# EAGLE design SparkFun RTK Facet - Display SD SIM (EAGLE 9.6.2)
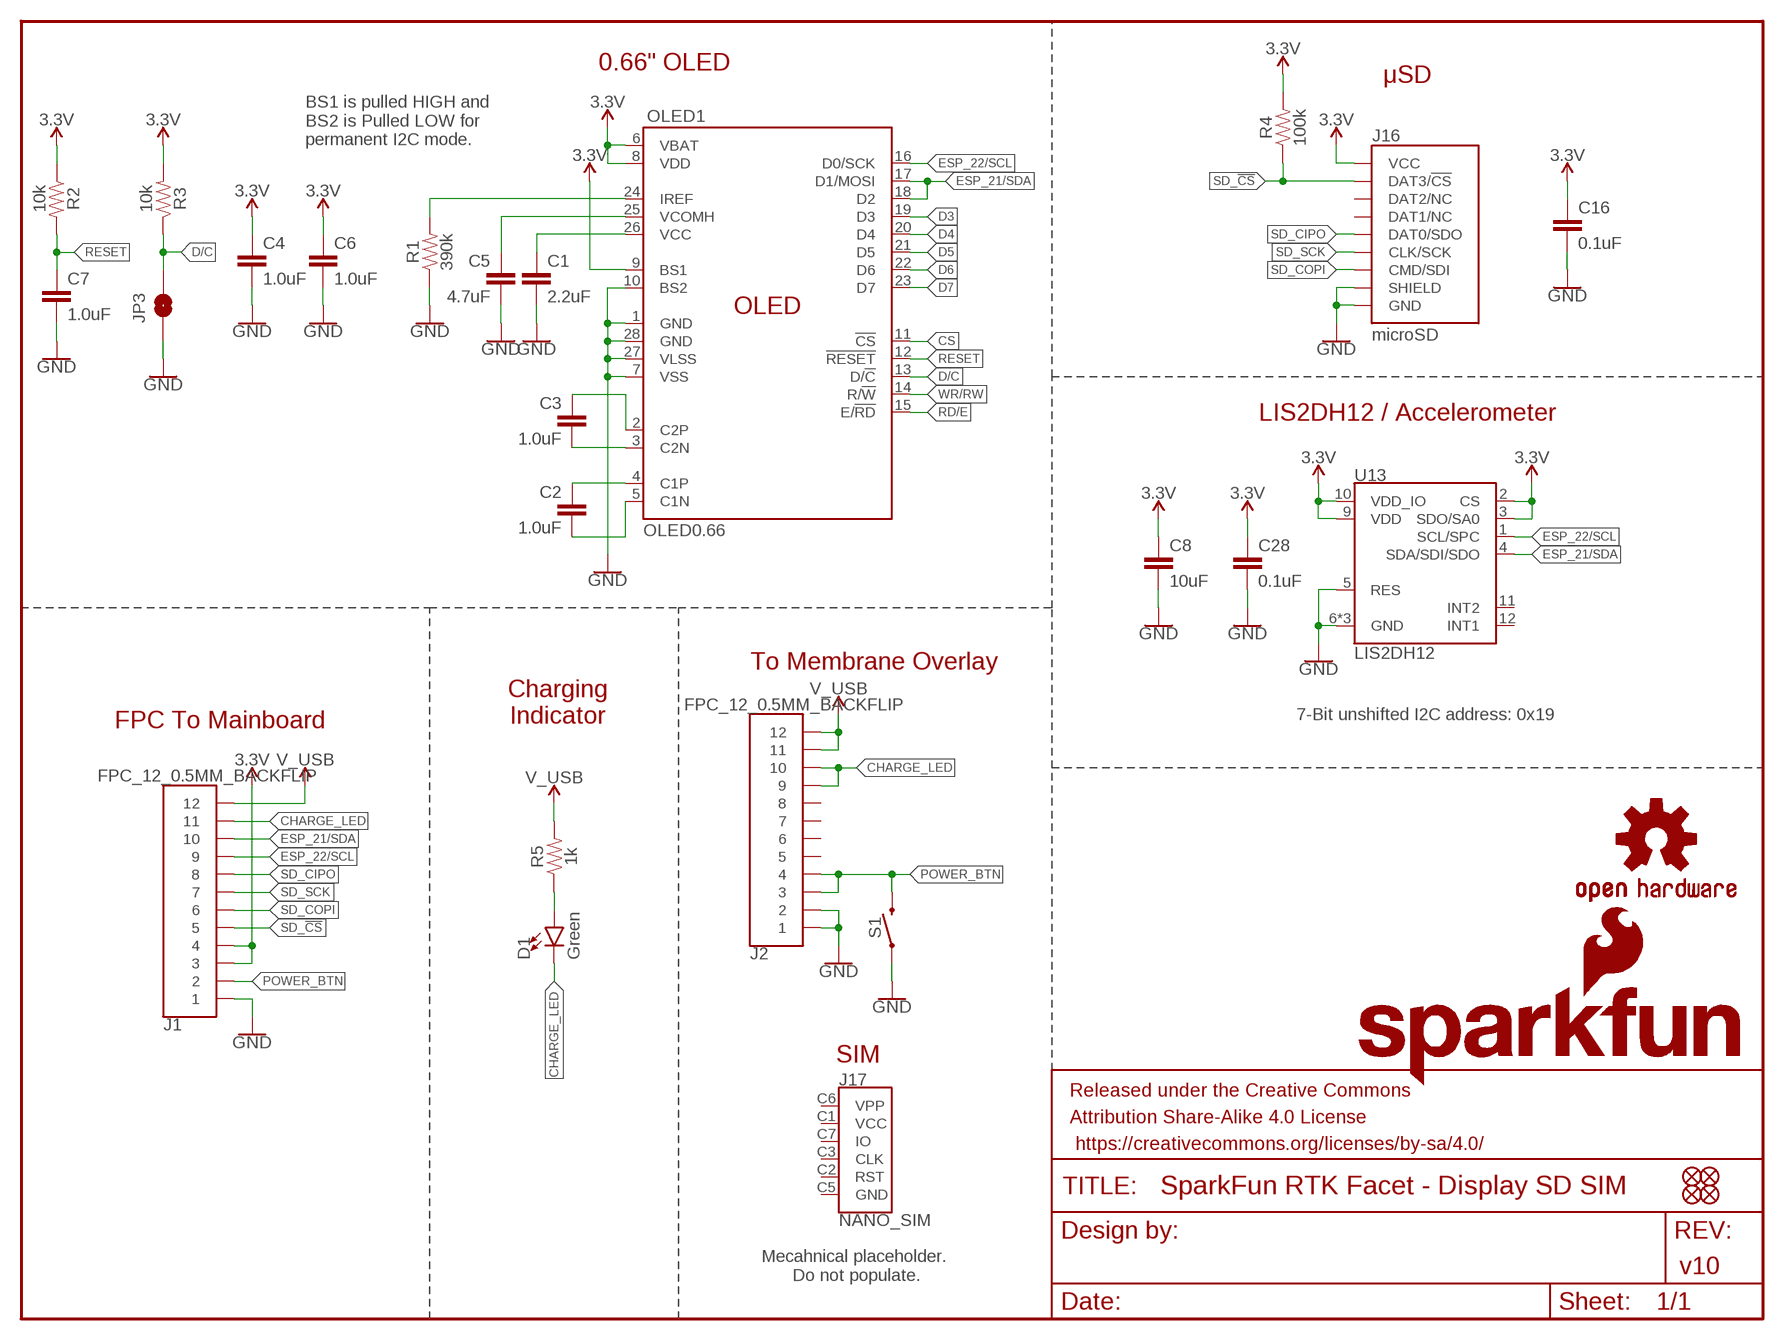
[diagram p0: schematic, sheet 1]

## Parts
C1  2.2uF  2.2UF-0805-25V-(+80/-20%)  [0805]
C2  1.0uF  1.0UF-0805-25V-10%  [0805]
C3  1.0uF  1.0UF-0805-25V-10%  [0805]
C4  1.0uF  1.0UF-0603-16V-10%  [0603]
C5  4.7uF  4.7UF-1206-16V-(+80/-20%)  [1206]
C6  1.0uF  1.0UF-0603-16V-10%  [0603]
C7  1.0uF  1.0UF-0603-16V-10%  [0603]
C8  10uF  10UF-0603-6.3V-20%  [0603]
C16  0.1uF  0.1UF-0603-25V-(+80/-20%)  [0603]
C28  0.1uF  0.1UF-0603-25V-(+80/-20%)  [0603]
D1  Green  LED-GREEN1206-BOTTOM  [LED-1206-BOTTOM]
FID1  FIDUCIAL1X2  [FIDUCIAL-1X2]
FID2  FIDUCIAL1X2  [FIDUCIAL-1X2]
FID3  FIDUCIAL1X2  [FIDUCIAL-1X2]
FID4  FIDUCIAL1X2  [FIDUCIAL-1X2]
FRAME1  FRAME-LETTER  [CREATIVE_COMMONS]
J1  FPC_12_0.5MM_BACKFLIP  [FPC_12_DOUBLESIDED_BACKFLIP]
J2  FPC_12_0.5MM_BACKFLIP  [FPC_12_DOUBLESIDED_BACKFLIP]
J16  microSD  MICRO-SD-SDIOPUSH-PUSH  [MICRO-SD-SOCKET]
J17  NANO_SIM  NANO_SIMWURTH  [NANO_SIM_WURTH_693043020611]
JP3  JUMPER-SMT_2_NO_SILK  [SMT-JUMPER_2_NO_SILK]
LOGO3  OSHW-LOGOMINI  [OSHW-LOGO-MINI]
LOGO5  SFE_LOGO_NAME_FLAME.1_INCH  [SFE_LOGO_NAME_FLAME_.1]
OLED1  OLED0.66  [OLED-0.66-64X48]
R1  390k  390KOHM-0603-1/10W-1%  [0603]
R2  10k  10KOHM-0603-1/10W-1%  [0603]
R3  10k  10KOHM-0603-1/10W-1%  [0603]
R4  100k  100KOHM-0603-1/10W-1%  [0603]
R5  1k  1KOHM-0603-1/10W-1%  [0603]
S1  MOMENTARY-SWITCH-SPST-SMD-5.2MM-TALL  [TACTILE_SWITCH_SMD_5.2MM]
U13  LIS2DH12  [LGA-12-LISDH12]

## Nets
3.3V [power]: C4.1 C6.1 C8.1 C16.1 C28.1 J1.3 J1.4 J16.VCC OLED1.6(VBAT) OLED1.8(VDD) OLED1.9(BS1) R2.1 R3.2 R4.2 U13.2(CS) U13.3(SDO/SA0) U13.9(VDD) U13.10(VDD_IO)
C1P: C2.1 OLED1.4(C1P)
C2N: C3.2 OLED1.3(C2N)
CHARGE_LED: D1.C J1.11 J2.9 J2.10
CS: OLED1.11(!CS!)
D3: OLED1.19(D3)
D4: OLED1.20(D4)
D5: OLED1.21(D5)
D6: OLED1.22(D6)
D7: OLED1.23(D7)
D/C: JP3.2 OLED1.13(D/!C!) R3.1
ESP_21/SDA: J1.10 OLED1.17(D1/MOSI) OLED1.18(D2) U13.4(SDA/SDI/SDO)
ESP_22/SCL: J1.9 OLED1.16(D0/SCK) U13.1(SCL/SPC)
GND: C1.2 C4.2 C5.2 C6.2 C7.2 C8.2 C16.2 C28.2 J1.1 J2.1 J2.2 J16.CD1(SHIELD) J16.GND J16.GND1(GND) J16.GND3(GND) JP3.1 OLED1.1(GND) OLED1.7(VSS) OLED1.10(BS2) OLED1.27(VLSS) OLED1.28(GND) R1.1 S1.1 U13.5(RES) U13.6(GND) U13.7(GND) U13.8(GND)
IREF: OLED1.24(IREF) R1.2
N$1: C3.1 OLED1.2(C2P)
N$2: C2.2 OLED1.5(C1N)
N$3: D1.A R5.1
POWER_BTN: J1.2 J2.3 J2.4 S1.3
RD/E: OLED1.15(E/!RD!)
RESET: C7.1 OLED1.12(!RESET!) R2.2
SD_!CS!: J1.5 J16.CS/DAT3(DAT3/!CS!) R4.1
SD_CIPO: J1.8 J16.DO/DAT0(DAT0/SDO)
SD_COPI: J1.6 J16.DI/CMD(CMD/SDI)
SD_SCK: J1.7 J16.SCLK(CLK/SCK)
V_USB: J1.12 J2.11 J2.12 R5.2
VCC: C1.1 OLED1.26(VCC)
VCOMH: C5.1 OLED1.25(VCOMH)
WR/RW: OLED1.14(R/!W!)
Unconnected: J2.5 J2.6 J2.7 J2.8 J16.DAT1(DAT1/NC) J16.DAT2(DAT2/NC) J17.C1(VCC) J17.C2(RST) J17.C3(CLK) J17.C5(GND) J17.C6(VPP) J17.C7(IO) U13.11(INT2) U13.12(INT1)

## Notes on the sheet
- 0.66" OLED
- μSD
- BS1 is pulled HIGH and 
  BS2 is Pulled LOW for 
  permanent I2C mode.
- LIS2DH12 / Accelerometer
- To Membrane Overlay
- Charging
  Indicator
- 7-Bit unshifted I2C address: 0x19
- FPC To Mainboard
- SIM
- Mecahnical placeholder. 
  Do not populate.
- v10

## Library data of the parts
C1 = SparkFun-Capacitors:2.2UF: 2.2µF ceramic capacitors A capacitor is a passive two-terminal electrical component used to store electrical energy temporarily in an electric field.; PROD_ID: CAP-11624
C2 C3 = SparkFun-Capacitors:1.0UF: 1µF ceramic capacitors A capacitor is a passive two-terminal electrical component used to store electrical energy temporarily in an electric field.; PROD_ID: CAP-08064
C4 C6 C7 = SparkFun-Capacitors:1.0UF: 1µF ceramic capacitors A capacitor is a passive two-terminal electrical component used to store electrical energy temporarily in an electric field.; PROD_ID: CAP-00868
C5 = SparkFun-Capacitors:4.7UF: 4.7µF ceramic capacitors A capacitor is a passive two-terminal electrical component used to store electrical energy temporarily in an electric field.; PROD_ID: CAP-10300
C8 = SparkFun-Capacitors:10UF: 10.0µF ceramic capacitors A capacitor is a passive two-terminal electrical component used to store electrical energy temporarily in an electric field.; PROD_ID: CAP-11015
C16 C28 = SparkFun-Capacitors:0.1UF: 0.1µF ceramic capacitors A capacitor is a passive two-terminal electrical component used to store electrical energy temporarily in an electric field.; PROD_ID: CAP-00810
D1 = SparkFun-LED:LED-GREEN: Green SMD LED Used in manufacturing of various products at SparkFun Packages: 0603 - SMD 0603 package [Product Link] <http://www.futureelectronics.com/en/technologies/semiconductors/optoelectronics/leds/Pages/9894312-LTST-C190GKT.aspx?CrossPart=HSMG-C190&IM=0> LilyPad 1206 - SMD1206 LilyPad package [Product Link] <http://www.futureelectronics.com/en/Technologies/Product.aspx?ProductID=IN150NGHARVATEKCORPORATION2049943&IM=0> 1206 - SMD1206 package [Product Link] <http://www.futureelectronics.com/en/technologies/semiconductors/optoelectronics/leds/Pages/8315665-LTST-C150KGKT.aspx?IM=0> 1206 Bottom Mount -SMD 1206 Bottom Mount [Product Link] <http://www.digikey.com/product-detail/en/lite-on-inc/LTST-C230KGKT/160-1456-1-ND/386854> SparkFun Products: Pro Mini 328 -5V <https://www.sparkfun.com/products/821> RedBoard <https://www.sparkfun.com/products/12757> MP3 Trigger <https://www.sparkfun.com/products/13720> Makey Makey <https://www.sparkfun.com/products/11076>; PROD_ID: DIO-11076
FID1-FID4 = SparkFun-Aesthetics:FIDUCIAL: Fiducial Alignment Points Point-of-reference for pick-and-place machines and other optical instruments.
FRAME1 = SparkFun-Aesthetics:FRAME-LETTER: Schematic Frame - Letter Standard 8.5x11 US Letter frame
J1 J2 = RTK Facet:FPC_12_0.5MM; PROD_ID: CONN-15766
J16 = SparkFun-Connectors:MICRO-SD-SDIO: microSD Socket for Transflash Push-push type µSD socket. tDoc lines correctly indicate media card edge positions when inserting (unlocked, locked, depressed). NOTE: CD1 and CD2 are connected internally, and the default detect state of the socket is detect pin to ground. SparkFun Products: WAV Trigger <https://www.sparkfun.com/products/13660> CAN-Bus Shield <https://www.sparkfun.com/products/13262> SparkFun Level Shifing microSD Breakout <https://www.sparkfun.com/products/13743>; PROD_ID: CONN-07820
J17 = ublox:NANO_SIM; PROD_ID: CONN-14097
JP3 = SparkFun-Jumpers:JUMPER-SMT_2_NO: Normally open jumper This jumper has two pads in close proximity to each other. Apply solder to close the connection. Round pads are easier to solder for beginners, but are a lot larger. SparkFun Product that uses the round pads: SparkFun EL Sequencer <https://www.sparkfun.com/products/12781>
LOGO3 = SparkFun-Aesthetics:OSHW-LOGO: Open-Source Hardware (OSHW) Logo This logo indicates the piece of hardware it is found on incorporates a OSHW license and/or adheres to the definition of open source hardware found here: http://freedomdefined.org/OSHW
LOGO5 = SparkFun-Aesthetics:SFE_LOGO_NAME_FLAME: SparkFun Font Logo w/ Flame This is the SparkFun full logo. The logo on the schematic will always be the same size; the package variant is the height of the flame part of the logo. Default layer for the logo on the board is tSilk.
OLED1 = SparkFun-Displays:OLED0.66: Micro OLED TODO: Add description SparkFun Products: Micro OLED Breakout <https://www.sparkfun.com/products/13003>; PROD_ID: LCD-12019
R1 = SparkFun-Resistors:390KOHM: 390kΩ resistor A resistor is a passive two-terminal electrical component that implements electrical resistance as a circuit element. Resistors act to reduce current flow, and, at the same time, act to lower voltage levels within circuits. - Wikipedia; PROD_ID: RES-12024
R2 R3 = SparkFun-Resistors:10KOHM: 10kΩ resistor A resistor is a passive two-terminal electrical component that implements electrical resistance as a circuit element. Resistors act to reduce current flow, and, at the same time, act to lower voltage levels within circuits. - Wikipedia; PROD_ID: RES-00824
R4 = SparkFun-Resistors:100KOHM: 100kΩ resistor A resistor is a passive two-terminal electrical component that implements electrical resistance as a circuit element. Resistors act to reduce current flow, and, at the same time, act to lower voltage levels within circuits. - Wikipedia; PROD_ID: RES-07828
R5 = SparkFun-Resistors:1KOHM: 1kΩ resistor A resistor is a passive two-terminal electrical component that implements electrical resistance as a circuit element. Resistors act to reduce current flow, and, at the same time, act to lower voltage levels within circuits. - Wikipedia; PROD_ID: RES-07856
S1 = SparkFun-Switches:MOMENTARY-SWITCH-SPST: Momentary Switch (Pushbutton) - SPST Normally-open (NO) SPST momentary switches (buttons, pushbuttons). Variants PTH-12MM - 12mm square, through-hole Momentary Pushbutton Switch - 12mm Square <https://www.sparkfun.com/products/9190> (COM-09190) PTH-6.0MM, PTH-6.0MM-KIT - 6.0mm square, through-hole Mini Pushbutton Switch <https://www.sparkfun.com/products/97> (COM-00097) KIT package intended for soldering kit's - only one side of pads' copper is exposed. PTH-RIGHT-ANGLE-KIT - Right-angle, through-hole Right Angle Tactile Button <https://www.sparkfun.com/products/10791> - Used on SparkFun BigTime Watch Kit <https://www.sparkfun.com/products/11734> SMD-12MM - 12mm square, surface-mount Tactile Button - SMD (12mm) <https://www.sparkfun.com/products/12993> (COM-12993) Used on SparkFun PicoBoard <https://www.sparkfun.com/products/11888> SMD-4.5MM - 4.5mm Square Trackball Switch Used on SparkFun Blackberry Trackballer Breakout <https://www.sparkfun.com/products/13169> SMD-4.6MMX2.8MM - 4.60mm x 2.80mm, surface mount Used on SparkFun SAMD21 Mini Breakout <https://www.sparkfun.com/products/13664> SMD-5.2MM, SMD-5.2-REDUNDANT - 5.2mm square, surface-mount Mini Pushbutton Switch - SMD <https://www.sparkfun.com/products/8720> (COM-08720) Used on Arduino Pro Mini <https://www.sparkfun.com/products/11114> REDUNDANT package connects both switch circuits together SMD-6.0X3.5MM - 6.0 x 3.5mm, surface mount Momentary Reset Switch SMD <https://www.sparkfun.com/products/8229> (COM-08229) SMD-6.2MM-TALL - 6.2mm square, surface mount Tactile Button - SMD (6mm) <https://www.sparkfun.com/products/12992> Used on SparkFun Digital Sandbox <https://www.sparkfun.com/products/12651> SMD-RIGHT-ANGLE - Right-angle, surface mount Used on SparkFun Block for Intel® Edison - Arduino <https://www.sparkfun.com/products/13036>; PROD_ID: SWCH-14139
U13 = SparkFun-Sensors:LIS2DH12; DIGIKEY: 497-14851-2-ND; PROD_ID: IC-14229

## Net classes
0 default: width 0.127 mm
1 power: width 0.178 mm

## Board
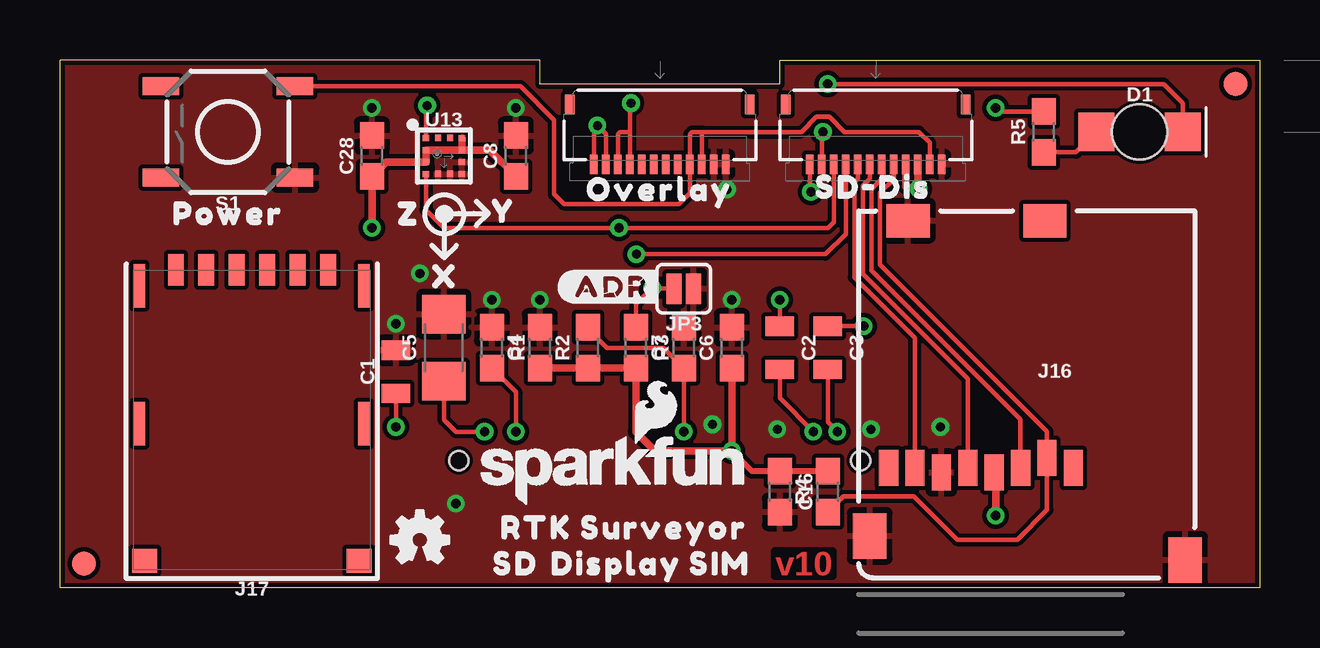
[diagram p1: board, top side]
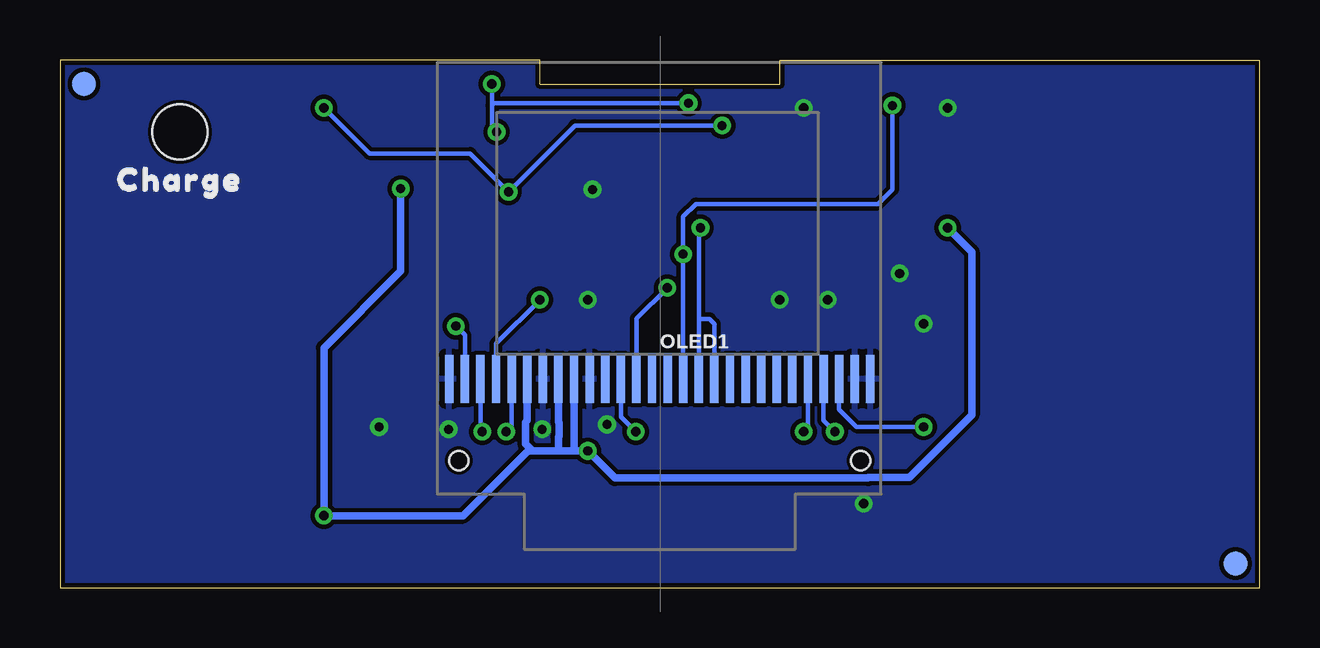
[diagram p2: board, bottom side, seen from below]

Size 50 x 22 mm. Coordinates in mm from the lower left corner, seen from the top.
Outline: 0,0 0,22 20,22 20,21 30,21 30,22 50,22 50,0 0,0
Copper layers (1*16): Top 0.035mm / dielectric 1.5mm / Bottom 0.035mm
Design rules "SparkFun-2-layer-TIGHT": minimum track width 7mil, minimum drill 15mil, track to track 7mil, track to pad 7mil, pad to pad 7mil, via to via 7mil, smd to smd 7mil, copper to edge 7mil, drill to drill 7mil, minimum pad ring 7mil, minimum via ring 7mil, stop-mask expansion 4mil, vias tented up to drill 25mil, thermal gap 10mil
tKeepout: area 48,0 to 50,22; area 0,0 to 2,22
bKeepout: area 48,0 to 50,22; area 0,0 to 2,22

### Footprints (pad centres in the part's own frame; a part is rotated, then mirrored left to right if it is on the bottom)
0805 = smd 0.8 x 1.2: 1 -0.9,0; 2 0.9,0
0603 = smd 1.1 x 1: 1 -0.85,0; 2 0.85,0
1206 = smd 1.6 x 1.8: 1 -1.4,0; 2 1.4,0
LED-1206-BOTTOM = smd 1.5 x 1.6: A -1.8,0; C 1.8,0 | hole 2.3: 0,0
FIDUCIAL-1X2 = smd 1 x 1: 1 0,0
FPC_12_DOUBLESIDED_BACKFLIP = smd 0.3 x 0.8: 1 -2.75,1.35; 2 -2.25,1.35; 3 -1.75,1.35; 4 -1.25,1.35; 5 -0.75,1.35; 6 -0.25,1.35; 7 0.25,1.35; 8 0.75,1.35; 9 1.25,1.35; 10 1.75,1.35; 11 2.25,1.35; 12 2.75,1.35 | smd 0.4 x 0.8: MP1 -3.75,-1.15; MP2 3.75,-1.15
MICRO-SD-SOCKET = smd 1.8 x 1.4: CD1 -2.05,0.4; CD2 -7.75,0.4 | smd 0.8 x 1.5: CS/DAT3 -7.84,10.3; DAT1 -1.24,10.7; DAT2 -8.94,10.7; DI/CMD -6.74,10.7; DO/DAT0 -2.34,10.7; GND -3.44,10.9; SCLK -4.54,10.7; VCC -5.64,10.9 | smd 1.4 x 1.9: GND1 -13.6,14.55; GND3 -0.45,13.55
NANO_SIM_WURTH_693043020611 = smd 0.65 x 1.3: C1 1.905,6.25; C2 -0.635,6.25; C3 -1.905,6.25; C5 3.175,6.25; C6 0.635,6.25; C7 -3.175,6.25 | smd 0.48 x 1.8: MNT1 -4.69,5.58; MNT2 4.66,5.58; MNT3 -4.69,-0.17; MNT4 4.66,-0.17 | smd 1.03 x 1: MNT5 -4.465,-5.89; MNT6 4.465,-5.89
SMT-JUMPER_2_NO_SILK = smd 0.635 x 1.27: 1 -0.406,0; 2 0.406,0
OLED-0.66-64X48 = smd 0.35 x 2: 1 -8.775,0; 2 -8.125,0; 3 -7.475,0; 4 -6.825,0; 5 -6.175,0; 6 -5.525,0; 7 -4.875,0; 8 -4.225,0; 9 -3.575,0; 10 -2.925,0; 11 -2.275,0; 12 -1.625,0; 13 -0.975,0; 14 -0.325,0; 15 0.325,0; 16 0.975,0; 17 1.625,0; 18 2.275,0; 19 2.925,0; 20 3.575,0; 21 4.225,0; 22 4.875,0; 23 5.525,0; 24 6.175,0; 25 6.825,0; 26 7.475,0; 27 8.125,0; 28 8.775,0 | hole 0.8: 8.375,-3.4; -8.375,-3.4
TACTILE_SWITCH_SMD_5.2MM = smd 1.524 x 0.762: 1 -2.794,1.905; 2 2.794,1.905; 3 -2.794,-1.905; 4 2.794,-1.905
LGA-12-LISDH12 = smd 0.275 x 0.25: 1 -0.75,0.75; 2 -0.75,0.25; 3 -0.75,-0.25; 4 -0.75,-0.75; 7 0.75,-0.75; 8 0.75,-0.25; 9 0.75,0.25; 10 0.75,0.75 | smd 0.25 x 0.275: 5 -0.25,-0.75; 6 0.25,-0.75; 11 0.25,0.75; 12 -0.25,0.75

### Placement (x,y rotation side)
C1  14,9 90 top
C2  30,10 270 top
C3  32,10 270 top
C4  20,10 90 top
C5  16,10 90 top
C6  28,10 90 top
C7  26,10 90 top
C8  19,18 90 top
C16  30,4 270 top
C28  13,18 90 top
D1  45,19 0 top
FID1  1,1 0 bottom
FID2  49,21 0 bottom
FID3  49,21 0 top
FID4  1,1 0 top
FRAME1  52.57,-29.5 0 bottom  (outside the outline)
J1  34,19 180 top
J2  25,19 180 top
J16  33.3,15.7 180 top
J17  8,7 0 top
JP3  26,12.46 180 top
LOGO3  15,2 0 top
LOGO5  23.1,4.9 0 top
OLED1  25,8.7 0 bottom
R1  18,10 270 top
R2  22,10 90 top
R3  24,10 270 top
R4  32,4 90 top
R5  41,19 90 top
S1  7,19 180 top
U13  16,18 0 top
U$1  [SD#DIS0]  33.9,16.7 0 top
U$2  [OVERLAY0]  25,16.6 0 top
U$3  [DISPLAY0]  23.2,1 0 top
U$4  [SD1]  19,1 0 top
U$5  [SIM2]  27.5,1 0 top
U$6  [RTK_SURVEYOR0]  23.5,2.5 0 top
U$7  [#ADR#0]  23,12.54 0 top
U$8  [CHARGE0]  45,17 0 bottom
U$9  [POWER0]  7,15.6 0 top
U$10  [X0]  15.9,13 180 top
U$11  [Y1]  18.5,15.7 0 top
U$12  [Z2]  14.4,15.6 180 top

### Tracks (layer width: path | path; a pad name or v marks a point on that pad's centre or on a via)
3.3V  (via drill 0.38)
  Top 0.254: R4.2 C16.1 28.85,4.85 v28,5.7
  Top 0.305: C4.1 R2.1 R3.2 24,6.5 24.8,5.7 v28,5.7 C6.1 | U13.9 U13.10 | U13.9 17.9,18.25 C8.1 | U13.9 U13.2 U13.3 13.6,17.75 C28.1 v13,15 | J16.VCC 39,4.74 v39,3 | J1.3 35.75,16.68 | J1.4 35.25,16.73 35.29,16.68 35.75,16.68 | v35.8,16.64 35.75,16.68
  Bottom 0.305: v13,15 12,14 12,7.2 14.6,4.6 16.29,4.6 16.32,4.57 26.87,4.57 v28,5.7 28.6,5.7 | 30.3,5.7 30.5,5.7 33.2,3 v39,3 39,10 35.8,13.2 v35.8,16.64 | 30.3,5.7 29.2,5.7 | 29.2,5.7 28.6,5.7 | OLED1.9 28.57,5.72 28.6,5.7 | 29.2,5.7 29.23,5.72 29.23,6.29 29.2,6.31 29.2,6.89 29.23,6.91 OLED1.8 | OLED1.6 30.52,6.96 30.6,6.89 30.6,6 30.3,5.7
C1P  (via drill 0.38)
  Top 0.178: v30,12 C2.1
  Bottom 0.178: OLED1.4 31.82,10.18 v30,12
C2N  (via drill 0.38)
  Top 0.178: C3.2 32,6.9 v32.4,6.5
  Bottom 0.178: v32.4,6.5 32.48,6.58 OLED1.3
CHARGE_LED  (via drill 0.38)
  Top 0.178: J2.9 23.75,19 | 23.75,19 23.75,20.15 v23.8,20.2 | J2.10 23.25,18.9 23.35,19 23.75,19 | J1.11 31.75,18.95 v31.8,19 | D1.C 46.8,20.2 46,21 v32,21
  Bottom 0.178: v23.8,20.2 31,20.2 31.4,20.2 31.9,20.2 32,20.1 | v32,21 32,20.1 | 32,20.1 32,19.2 v31.8,19
D/C  (via drill 0.38)
  Top 0.178: JP3.2 24.73,12.46 v24.68,12.5 24,11.81 R3.1
  Bottom 0.178: OLED1.13 25.98,11.21 v24.68,12.5
ESP_21/SDA  (via drill 0.38)
  Top 0.178: J1.10 32.25,15.25 32,15 31.3,15 30.8,15 v23.3,15 16,15 15.25,15.75 U13.4
  Bottom 0.178: OLED1.18 22.73,11 22.93,11.2 23.38,11.2 | v23.3,15 23.38,14.93 23.38,11.2 | OLED1.17 23.38,11.2
ESP_22/SCL  (via drill 0.38)
  Top 0.178: J1.9 32.75,14.75 31.9,13.9 v24.02,13.9 | U13.1 15.25,20.05 v15.3,20.1
  Bottom 0.178: v15.3,20.1 15.3,16.6 15.9,16 23.5,16 24.02,15.47 v24.02,13.9 OLED1.16
GND  (via drill 0.38)
  other vias: 27.8,16.6 28,12 20,12 18,12 13,20 36.7,6.7 33.8,6.6 16.5,3.5 29.9,6.6 27.2,6.8 14,11 15,13.1 19,20
  pour Top (isolate 0.152): 0,0 0,22 50,22 50,0
  pour Bottom (isolate 0.152): 0,0 0,22 50,22 50,0
IREF  (via drill 0.38)
  Top 0.178: R1.2 19,8.15 v19,6.5
  Bottom 0.178: OLED1.24 18.82,6.67 v19,6.5
N$1  (via drill 0.38)
  Top 0.178: v33.5,10.9 C3.1
  Bottom 0.178: OLED1.2 33.12,10.53 v33.5,10.9
N$2  (via drill 0.38)
  Top 0.178: C2.2 30,7.9 v31.4,6.5
  Bottom 0.178: v31.4,6.5 31.18,6.72 OLED1.5
N$3
  Top 0.178: D1.A 42.35,18.15 R5.1
POWER_BTN
  Top 0.178: 26.8,19 26.35,19 26.25,18.9 J2.4 26.25,16.45 25.8,16 21,16 20.6,16.4 20.6,19.5 19.2,20.91 S1.3 | J2.3 26.75,18.95 26.8,19 | 26.8,19 30.9,19 31.54,19.64 32.06,19.64 32.7,19 35.8,19 36.25,18.55 J1.2
RESET  (via drill 0.38)
  Top 0.178: R2.2 22,10.8 22.8,10 25.15,10 C7.1 v26,6.5
  Bottom 0.178: OLED1.12 26.62,7.12 v26,6.5
SD_!CS!
  Top 0.178: R4.1 32.65,3.8 35.6,3.8 37.4,2 39.9,2 41.14,3.24 J16.CS/DAT3 41.14,6.51 34.17,13.48 34.17,16.46 34.75,17.04 J1.5
SD_CIPO
  Top 0.178: J16.DO/DAT0 35.64,10.4 33.37,12.67 33.25,12.79 33.11,12.93 33.11,16.91 33.25,17.05 J1.8
SD_COPI
  Top 0.178: J16.DI/CMD 40.04,6.7 40.04,7.01 33.82,13.23 33.82,16.61 34.25,17.04 J1.6
SD_SCK
  Top 0.178: J16.SCLK 37.84,8.7 33.46,13.08 33.46,16.76 33.75,17.05 J1.7
V_USB  (via drill 0.38)
  Top 0.178: J2.11 22.75,18.91 v22.4,19.27 22.4,19.05 22.25,18.9 J2.12 | J1.12 31.25,16.55 v31.3,16.5 | R5.2 39.15,19.85 v39,20
  Bottom 0.178: v22.4,19.27 28.54,19.27 v31.3,16.5 32.9,18.1 37.1,18.1 v39,20
VCC  (via drill 0.38)
  Top 0.178: v14,6.7 C1.1
  Bottom 0.178: OLED1.26 17.52,7.42 16.8,6.7 v14,6.7
VCOMH  (via drill 0.38)
  Top 0.178: v17.7,6.5 16.5,6.5 16,7 C5.1
  Bottom 0.178: OLED1.25 18.18,6.97 v17.7,6.5

### Text on the board
Top: v10
tDocu: FPC stiffener is 3mm